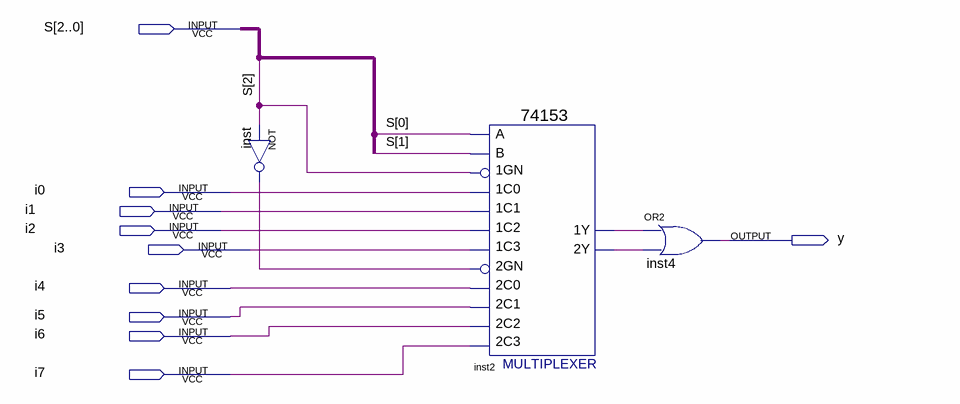
[diagram p0: schematic sheet]
// Quartus schematic teste1.bdf as structural Verilog: 3 symbols, 10 pins
module teste1 (
  input  [2:0] S,
  input  i0,
  input  i1,
  input  i2,
  input  i3,
  input  i4,
  input  i5,
  input  i6,
  input  i7,
  output y
);

  wire inst2_1y, inst2_2y, inst_out;

  not inst (inst_out, S[2]);
  \74153  inst2 (
    .\1C1 (i1), .\1GN (S[2]), .\1C0 (i0), .\2C0 (i4), .\2GN (inst_out), .\2C2 (i6), .\1C2 (i2), .\1C3 (i3),
    .B(S[1]), .A(S[0]), .\2C1 (i5), .\2C3 (i7), .\1Y (inst2_1y), .\2Y (inst2_2y));
  or inst4 (y, inst2_1y, inst2_2y);
endmodule
